# Altium schematic sheet CD74HC4067_MUX_1.SchDoc
size A
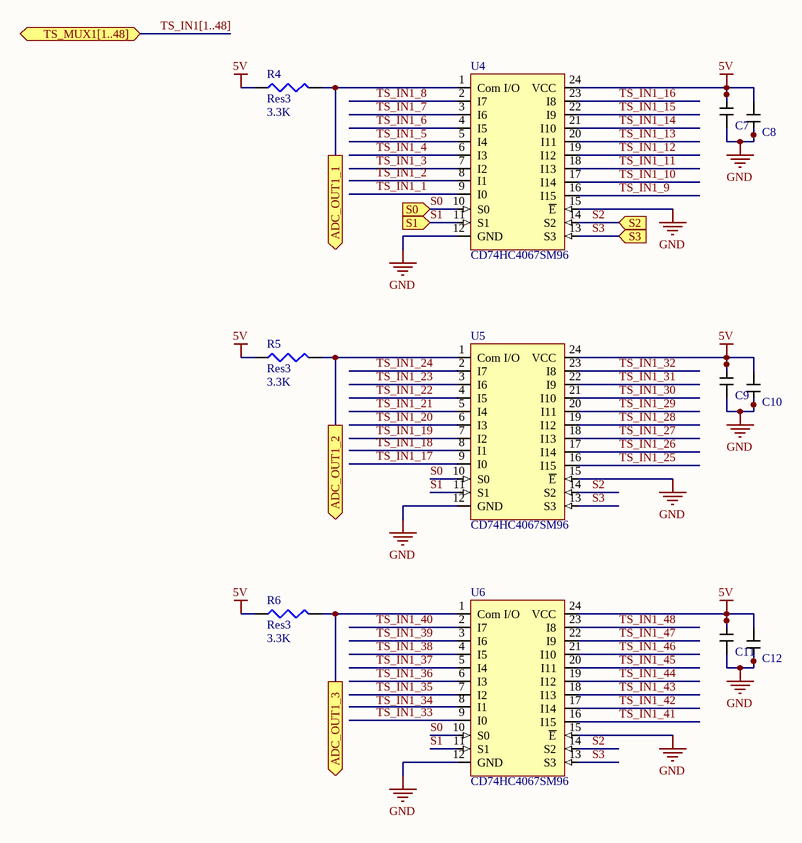
[diagram p0: CD74HC4067_MUX_1.SchDoc]

## Parts
C7  0.1uF Cap  [CAPC1608X09M]  (value not drawn)
C8  1uF Samsung Cap  [CAPC1608X09M]  (value not drawn)
C9  0.1uF Cap  [CAPC1608X09M]  (value not drawn)
C10  1uF Samsung Cap  [CAPC1608X09M]  (value not drawn)
C11  0.1uF Cap  [CAPC1608X09M]  (value not drawn)
C12  1uF Samsung Cap  [CAPC1608X09M]  (value not drawn)
R4  Res3  value 3.3K  [J1-0603]
R5  Res3  value 3.3K  [J1-0603]
R6  Res3  value 3.3K  [J1-0603]
U4  CD74HC4067SM96  [SOIC-24_MUX]
U5  CD74HC4067SM96  [SOIC-24_MUX]
U6  CD74HC4067SM96  [SOIC-24_MUX]

## Ports
ADC_OUT1_1 (out), ADC_OUT1_2 (out), ADC_OUT1_3 (out), S0 (in), S1 (in), S2 (in), S3 (in), TS_MUX1[1..48] (bidir)

## Nets
5V: C7.2 C8.2 C9.2 C10.2 C11.2 C12.2 R4.1 R5.1 R6.1 U4.24(VCC) U5.24(VCC) U6.24(VCC)
GND: C7.1 C8.1 C9.1 C10.1 C11.1 C12.1 U4.12(GND) U4.15(~{E}) U5.12(GND) U5.15(~{E}) U6.12(GND) U6.15(~{E})
ADC_OUT1_1: R4.2 U4.1(Com_I/O) ; port ADC_OUT1_1
ADC_OUT1_2: R5.2 U5.1(Com_I/O) ; port ADC_OUT1_2
ADC_OUT1_3: R6.2 U6.1(Com_I/O) ; port ADC_OUT1_3
S0: U4.10(S0) U5.10(S0) U6.10(S0) ; port S0
S1: U4.11(S1) U5.11(S1) U6.11(S1) ; port S1
S2: U4.14(S2) U5.14(S2) U6.14(S2) ; port S2
S3: U4.13(S3) U5.13(S3) U6.13(S3) ; port S3
TS_IN1_1: U4.9(I0)
TS_IN1_2: U4.8(I1)
TS_IN1_3: U4.7(I2)
TS_IN1_4: U4.6(I3)
TS_IN1_5: U4.5(I4)
TS_IN1_6: U4.4(I5)
TS_IN1_7: U4.3(I6)
TS_IN1_8: U4.2(I7)
TS_IN1_9: U4.16(I15)
TS_IN1_10: U4.17(I14)
TS_IN1_11: U4.18(I13)
TS_IN1_12: U4.19(I12)
TS_IN1_13: U4.20(I11)
TS_IN1_14: U4.21(I10)
TS_IN1_15: U4.22(I9)
TS_IN1_16: U4.23(I8)
TS_IN1_17: U5.9(I0)
TS_IN1_18: U5.8(I1)
TS_IN1_19: U5.7(I2)
TS_IN1_20: U5.6(I3)
TS_IN1_21: U5.5(I4)
TS_IN1_22: U5.4(I5)
TS_IN1_23: U5.3(I6)
TS_IN1_24: U5.2(I7)
TS_IN1_25: U5.16(I15)
TS_IN1_26: U5.17(I14)
TS_IN1_27: U5.18(I13)
TS_IN1_28: U5.19(I12)
TS_IN1_29: U5.20(I11)
TS_IN1_30: U5.21(I10)
TS_IN1_31: U5.22(I9)
TS_IN1_32: U5.23(I8)
TS_IN1_33: U6.9(I0)
TS_IN1_35: U6.7(I2)
TS_IN1_36: U6.6(I3)
TS_IN1_37: U6.5(I4)
TS_IN1_38: U6.4(I5)
TS_IN1_39: U6.3(I6)
TS_IN1_40: U6.2(I7)
TS_IN1_41: U6.16(I15)
TS_IN1_42: U6.17(I14)
TS_IN1_43: U6.18(I13)
TS_IN1_44: U6.19(I12)
TS_IN1_45: U6.20(I11)
TS_IN1_46: U6.21(I10)
TS_IN1_47: U6.22(I9)
TS_IN1_48: U6.23(I8)

Not connected (* = marked no-connect by the designer): U6 8(I1)

## Buses and harness runs
bus TS_IN1[1..48] = port TS_MUX1[1..48]

## Notes on the sheet
- Labels drawn without touching a wire or pin: TS_IN1_34

## Library data of the parts
C7 C9 C11 = 0.1uF Cap: C0603C101K8GAC7867 Kemet Capacitor; Supplier 1: Digi-Key; Supplier Part Number 1: 399-14477-1-ND
R4-R6 = Res3: Resistor; Published: 8-Jun-2000; LatestRevisionDate: 29-May-2009; LatestRevisionNote: IPC-7351 Footprint Added.; PackageReference: J1-0603; Publisher: Altium Limited; PackageDescription: Chip Resistor
C8 C10 C12 = 1uF Samsung Cap: Supplier 1: Digi-Key; Supplier Part Number 1: 1276-1946-1-ND
U4-U6 = CD74HC4067SM96: Supplier Part Number 1: 05B6161; Supplier 1: Newark